# EAGLE schematic chok_boi (EAGLE 8.3.2)
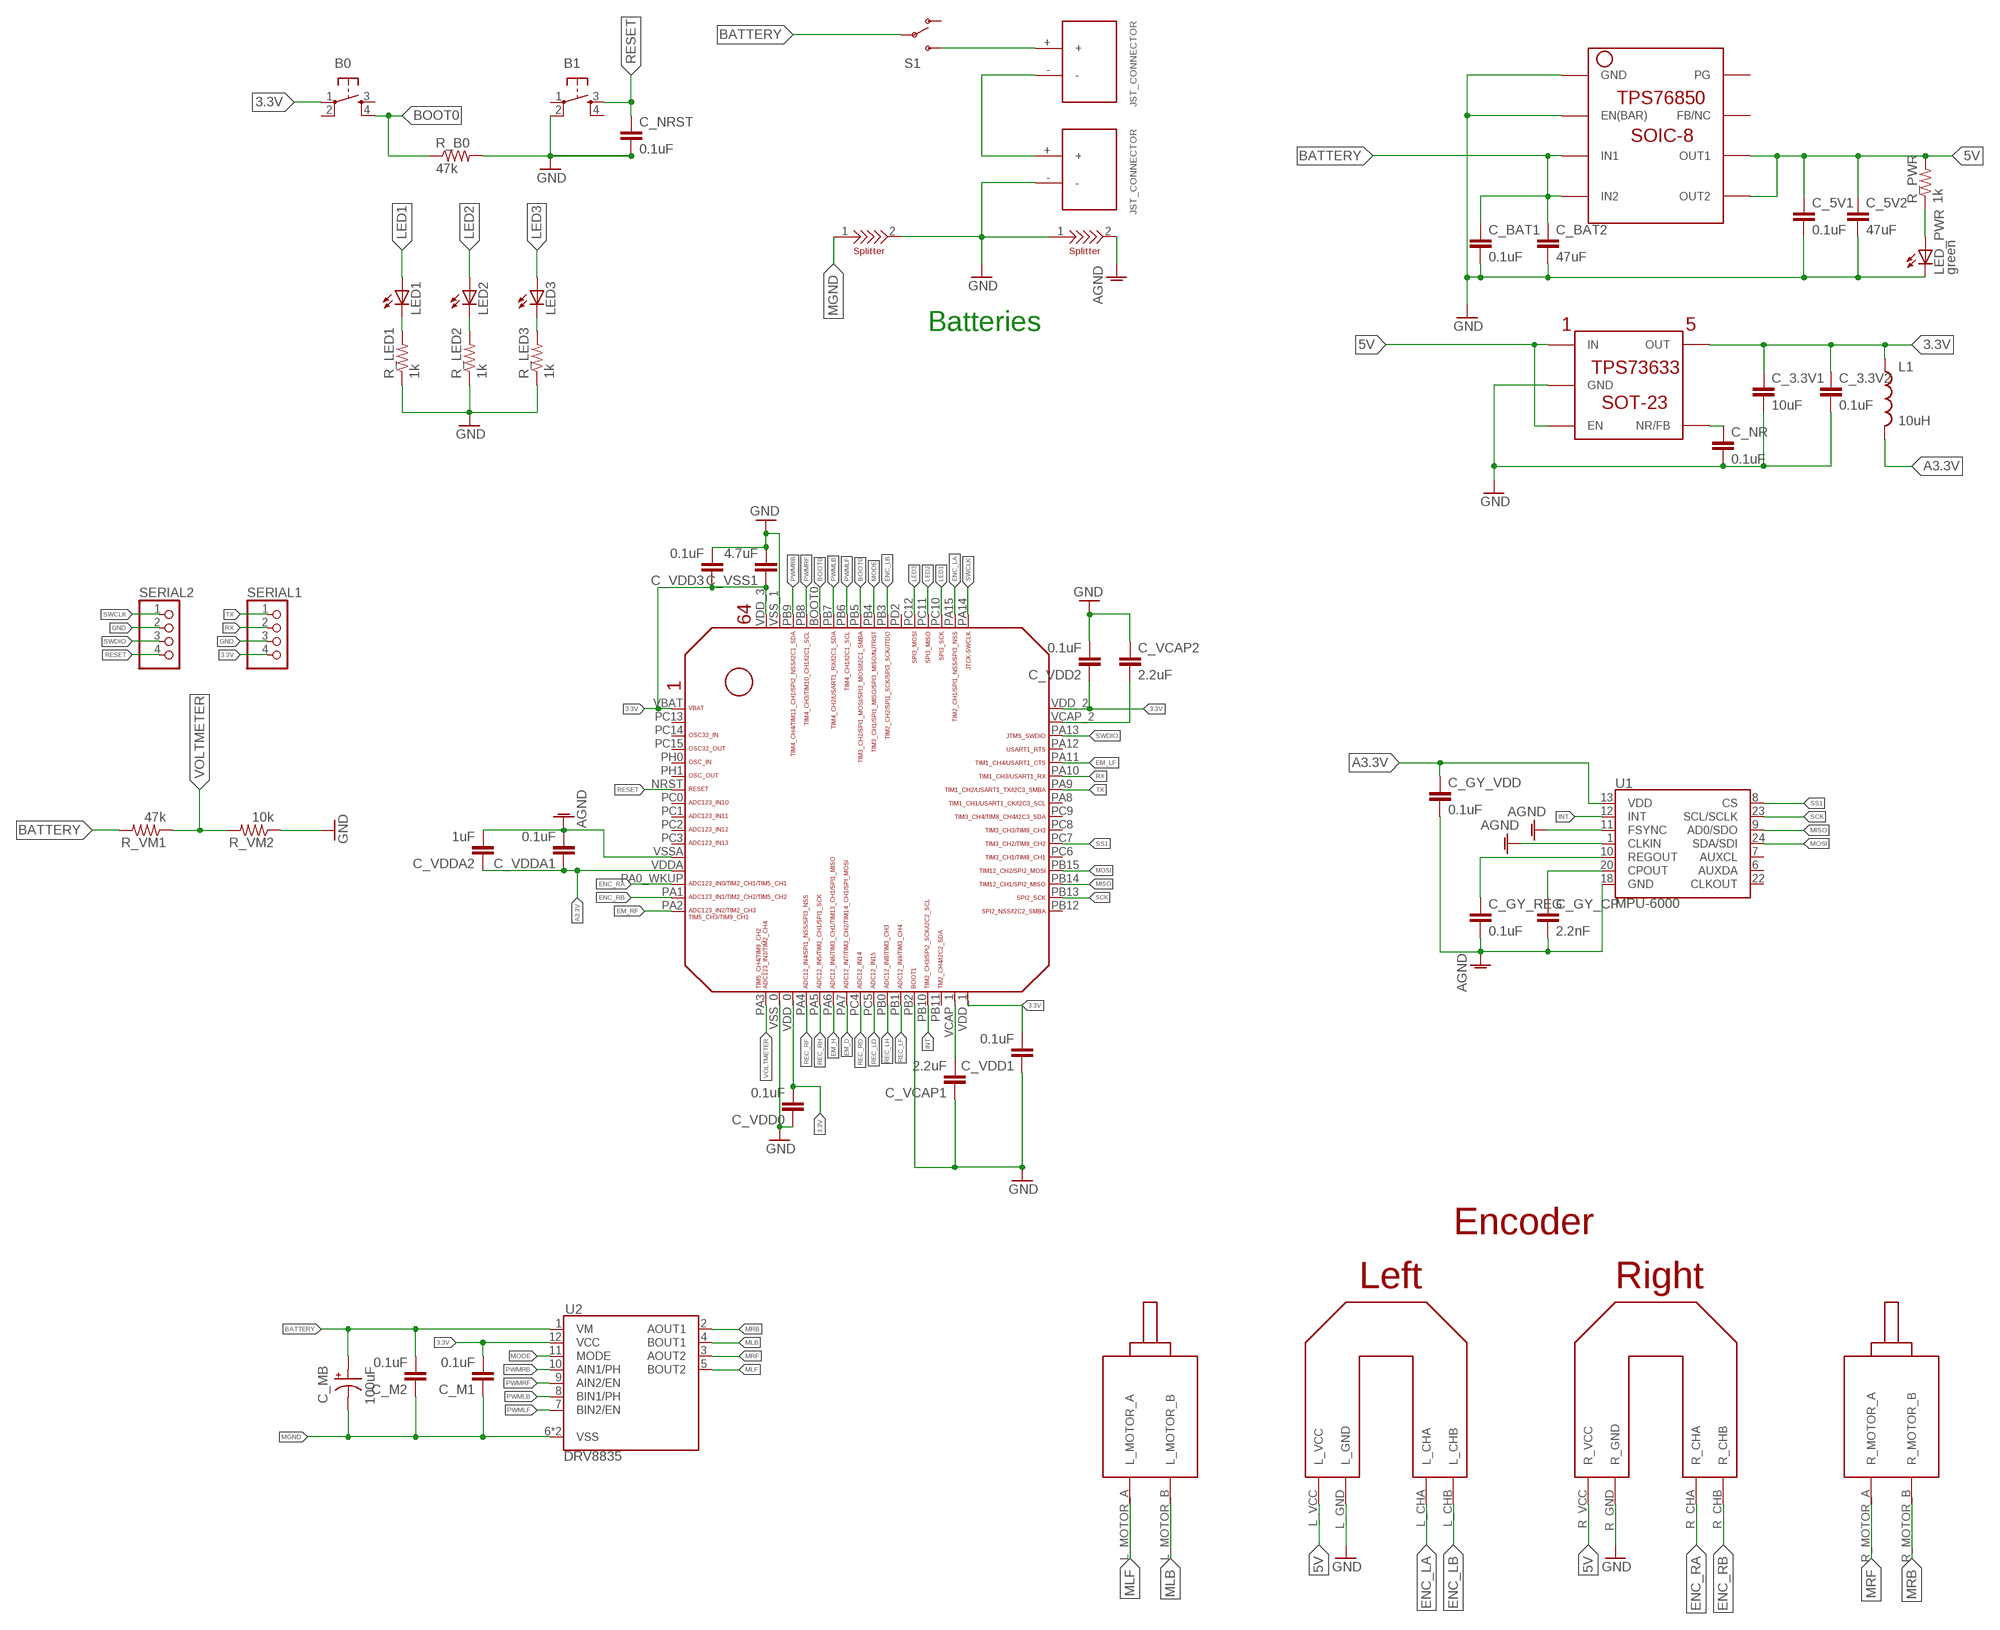
[diagram p0: schematic, sheet 1, part 1 of 2]
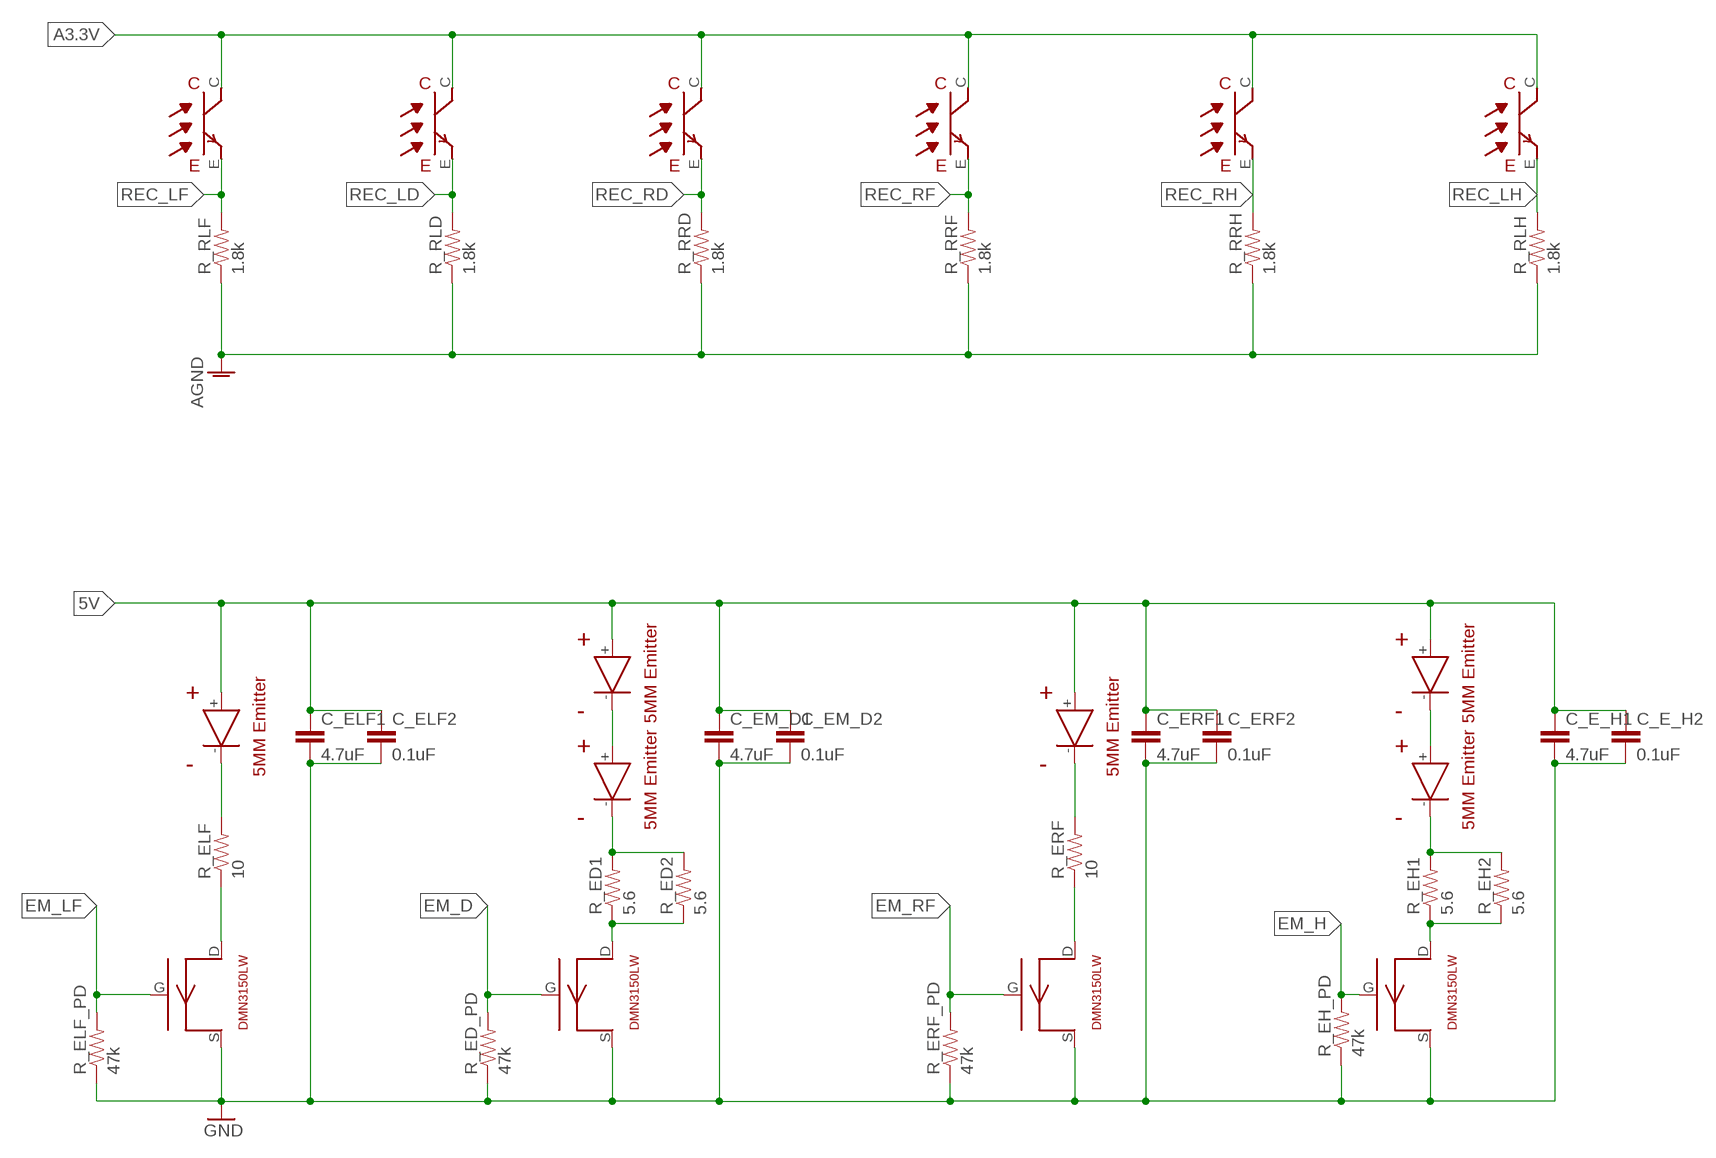
[diagram p1: schematic, sheet 1, part 2 of 2]

## Parts
B0  TAC_SWITCHSMD  [TACTILE-SWITCH-SMD]
B1  TAC_SWITCHSMD  [TACTILE-SWITCH-SMD]
C_3.3V1  10uF  CAP0603-CAP  [0603-CAP]
C_3.3V2  0.1uF  CAP0603-CAP  [0603-CAP]
C_5V1  0.1uF  CAP0603-CAP  [0603-CAP]
C_5V2  47uF  CAP1210  [1210]
C_BAT1  0.1uF  CAP0603-CAP  [0603-CAP]
C_BAT2  47uF  CAP1210  [1210]
C_E_H1  4.7uF  CAP0603-CAP  [0603-CAP]
C_E_H2  0.1uF  CAP0603-CAP  [0603-CAP]
C_ELF1  4.7uF  CAP0603-CAP  [0603-CAP]
C_ELF2  0.1uF  CAP0603-CAP  [0603-CAP]
C_EM_D1  4.7uF  CAP0603-CAP  [0603-CAP]
C_EM_D2  0.1uF  CAP0603-CAP  [0603-CAP]
C_ERF1  4.7uF  CAP0603-CAP  [0603-CAP]
C_ERF2  0.1uF  CAP0603-CAP  [0603-CAP]
C_GY_CP  2.2nF  CAP0603-CAP  [0603-CAP]
C_GY_REG  0.1uF  CAP0603-CAP  [0603-CAP]
C_GY_VDD  0.1uF  CAP0603-CAP  [0603-CAP]
C_M1  0.1uF  CAP0603-CAP  [0603-CAP]
C_M2  0.1uF  CAP0603-CAP  [0603-CAP]
C_MB  100uF  T491X107K025AT  [X]
C_NR  0.1uF  CAP0603-CAP  [0603-CAP]
C_NRST  0.1uF  CAP0603-CAP  [0603-CAP]
C_VCAP1  2.2uF  CAP0603-CAP  [0603-CAP]
C_VCAP2  2.2uF  CAP0603-CAP  [0603-CAP]
C_VDD0  0.1uF  CAP0603-CAP  [0603-CAP]
C_VDD1  0.1uF  CAP0603-CAP  [0603-CAP]
C_VDD2  0.1uF  CAP0603-CAP  [0603-CAP]
C_VDD3  0.1uF  CAP0603-CAP  [0603-CAP]
C_VDDA1  0.1uF  CAP0603-CAP  [0603-CAP]
C_VDDA2  1uF  CAP0603-CAP  [0603-CAP]
C_VSS1  4.7uF  CAP0603-CAP  [0603-CAP]
L1  10uH  INDUCTOR1007  [1007]
LED1  LED0603  [LED-0603]
LED2  LED0603  [LED-0603]
LED3  LED0603  [LED-0603]
LED_PWR  green  LED1206  [LED-1206]
LEFT_FRONT_EMITTER  EMITTER  [EMITTER]
NMOS1  DMN3150LW  [DMN3150LW]
NMOS2  DMN3150LW  [DMN3150LW]
NMOS3  DMN3150LW  [DMN3150LW]
NMOS4  DMN3150LW  [DMN3150LW]
R_B0  47k  RESISTOR0603-RES  [0603-RES]
R_ED1  5.6  RESISTOR0603-RES  [0603-RES]
R_ED2  5.6  RESISTOR0603-RES  [0603-RES]
R_ED_PD  47k  RESISTOR0603-RES  [0603-RES]
R_EH1  5.6  RESISTOR0603-RES  [0603-RES]
R_EH2  5.6  RESISTOR0603-RES  [0603-RES]
R_EH_PD  47k  RESISTOR0603-RES  [0603-RES]
R_ELF  10  RESISTOR0603-RES  [0603-RES]
R_ELF_PD  47k  RESISTOR0603-RES  [0603-RES]
R_ERF  10  RESISTOR0603-RES  [0603-RES]
R_ERF_PD  47k  RESISTOR0603-RES  [0603-RES]
R_LED1  1k  RESISTOR0603-RES  [0603-RES]
R_LED2  1k  RESISTOR0603-RES  [0603-RES]
R_LED3  1k  RESISTOR0603-RES  [0603-RES]
R_PWR  1k  RESISTOR0603-RES  [0603-RES]
R_RLD  1.8k  RESISTOR0603-RES  [0603-RES]
R_RLF  1.8k  RESISTOR0603-RES  [0603-RES]
R_RLH  1.8k  RESISTOR0603-RES  [0603-RES]
R_RRD  1.8k  RESISTOR0603-RES  [0603-RES]
R_RRF  1.8k  RESISTOR0603-RES  [0603-RES]
R_RRH  1.8k  RESISTOR0603-RES  [0603-RES]
R_VM1  47k  RESISTOR0603-RES  [0603-RES]
R_VM2  10k  RESISTOR0603-RES  [0603-RES]
REC_LF  RECEIVER  [RECEIVER]
S1  SWITCH-SPSTPTH  [SWITCH-SPDT]
SERIAL1  PINHD-1X4  [1X04]
SERIAL2  PINHD-1X4  [1X04]
U1  MPU-6000  [QFN-24-EP]
U2  DRV8835  DRV883X  [WSON-12]
U$1  JST_CONNECTOR_FEMALE  [JST_CONNECTOR_FEMALE]
U$2  JST_CONNECTOR_FEMALE  [JST_CONNECTOR_FEMALE]
U$3  TPS73633(SOT-23)  [TPS73633(SOT-23)]
U$4  TPS76850(SOIC-8)  [TPS76850(SOIC-8)]
U$5  STM32F405/415_LQFP64  [STM32F405/415_LQFP64]
U$7  RECEIVER  [RECEIVER]
U$8  RECEIVER  [RECEIVER]
U$9  RECEIVER  [RECEIVER]
U$11  EMITTER  [EMITTER]
U$12  FUTURA_V1.0_MOTOR_MOUNT  [FUTURA_V1.0_MOTOT_MOUNT]
U$13  EMITTER  [EMITTER]
U$15  SPLITTER  [SPLITTER]
U$16  SPLITTER  [SPLITTER]
U$17  EMITTER  [EMITTER]
U$18  EMITTER  [EMITTER]
U$19  EMITTER  [EMITTER]
U$20  RECEIVER  [RECEIVER]
U$21  RECEIVER  [RECEIVER]

## Nets
3.3V: B0.1 C_3.3V1.1 C_3.3V2.1 C_M1.2 C_VDD0.2 C_VDD1.2 C_VDD2.1 C_VDD3.1 C_VSS1.1 L1.1 SERIAL1.4 U2.12(VCC) U$3.OUT U$5.VBAT U$5.VDD_0 U$5.VDD_1 U$5.VDD_2 U$5.VDD_3
5V: C_5V1.1 C_5V2.1 C_E_H1.1 C_E_H2.1 C_ELF1.1 C_ELF2.1 C_EM_D1.1 C_EM_D2.1 C_ERF1.1 C_ERF2.1 LEFT_FRONT_EMITTER.+ R_PWR.2 U$3.EN U$3.IN U$4.OUT1 U$4.OUT2 U$11.+ U$12.L_VCC U$12.R_VCC U$13.+ U$18.+
A3.3V: C_GY_VDD.1 C_VDDA1.1 C_VDDA2.1 L1.2 REC_LF.C U1.13(VDD) U$5.VDDA U$7.C U$8.C U$9.C U$20.C U$21.C
AGND: C_GY_CP.2 C_GY_REG.2 C_GY_VDD.2 C_VDDA1.2 C_VDDA2.2 R_RLD.1 R_RLF.1 R_RLH.1 R_RRD.1 R_RRF.1 R_RRH.1 U1.1(CLKIN) U1.11(FSYNC) U1.18(GND) U$5.VSSA U$15.2
BATTERY: C_BAT1.1 C_BAT2.1 C_M2.2 C_MB.A R_VM1.2 S1.2(P) U2.1(VM) U$4.IN1 U$4.IN2
BOOT0: B0.4 R_B0.1 U$5.BOOT0 U$5.PB5
D2_EM: R_ED1.2 R_ED2.2 U$17.-
D_EM: U$11.- U$17.+
EM_D: NMOS2.G R_ED_PD.2 U$5.PA7
EM_H: NMOS4.G R_EH_PD.2 U$5.PA6
EM_LF: NMOS1.G R_ELF_PD.2 U$5.PA11
EM_RF: NMOS3.G R_ERF_PD.2 U$5.PA2
ENC_LA: U$5.PA15 U$12.L_CHA
ENC_LB: U$5.PB3 U$12.L_CHB
ENC_RA: U$5.PA0_WKUP(PA0_AKUP) U$12.R_CHA
ENC_RB: U$5.PA1 U$12.R_CHB
GND: B1.2 C_3.3V1.2 C_3.3V2.2 C_5V1.2 C_5V2.2 C_BAT1.2 C_BAT2.2 C_E_H1.2 C_E_H2.2 C_ELF1.2 C_ELF2.2 C_EM_D1.2 C_EM_D2.2 C_ERF1.2 C_ERF2.2 C_NR.2 C_NRST.2 C_VCAP1.1 C_VCAP2.1 C_VDD0.1 C_VDD1.1 C_VDD2.2 C_VDD3.2 C_VSS1.2 LED_PWR.C NMOS1.S NMOS2.S NMOS3.S NMOS4.S R_B0.2 R_ED_PD.1 R_EH_PD.1 R_ELF_PD.1 R_ERF_PD.1 R_LED1.1 R_LED2.1 R_LED3.1 R_VM2.1 SERIAL1.3 SERIAL2.2 U$1.- U$3.GND U$4.EN(BAR) U$4.GND U$5.PB2 U$5.VSS_0 U$5.VSS_1 U$12.L_GND U$12.R_GND U$15.1 U$16.2
H2_EM: R_EH1.2 R_EH2.2 U$19.-
H_EM: U$18.- U$19.+
INT: U1.12(INT) U$5.PB10
LED1: LED1.A U$5.PC10
LED2: LED2.A U$5.PC11
LED3: LED3.A U$5.PC12
LF_EM: LEFT_FRONT_EMITTER.- R_ELF.2
MGND: C_M1.1 C_M2.1 C_MB.C U2.6(VSS) U2.PAD(VSS) U$16.1
MISO: U1.9(AD0/SDO) U$5.PB14
MLB: U2.4(BOUT1) U$12.L_MOTOR_B
MLF: U2.5(BOUT2) U$12.L_MOTOR_A
MODE: U2.11(MODE) U$5.PB4
MOSI: U1.24(SDA/SDI) U$5.PB15
MRB: U2.2(AOUT1) U$12.R_MOTOR_B
MRF: U2.3(AOUT2) U$12.R_MOTOR_A
N$1: U$1.+ U$2.-
N$2: S1.3(S) U$2.+
N$3: C_NR.1 U$3.NR/FB
N$4: C_VCAP1.2 U$5.VCAP_1
N$5: NMOS3.D R_ERF.1
N$6: C_VCAP2.2 U$5.VCAP_2
N$7: NMOS1.D R_ELF.1
N$8: LED_PWR.A R_PWR.1
N$12: LED1.C R_LED1.2
N$16: LED2.C R_LED2.2
N$18: NMOS2.D R_ED1.1 R_ED2.1
N$19: NMOS4.D R_EH1.1 R_EH2.1
N$20: C_GY_REG.1 U1.10(REGOUT)
N$21: LED3.C R_LED3.2
N$22: C_GY_CP.1 U1.20(CPOUT)
PWMLB: U2.8(BIN1/PH) U$5.PB7
PWMLF: U2.7(BIN2/EN) U$5.PB6
PWMRB: U2.10(AIN1/PH) U$5.PB9
PWMRF: U2.9(AIN2/EN) U$5.PB8
REC_LD: R_RLD.2 U$5.PC5 U$7.E
REC_LF: R_RLF.2 REC_LF.E U$5.PB1
REC_LH: R_RLH.2 U$5.PB0 U$21.E
REC_RD: R_RRD.2 U$5.PC4 U$8.E
REC_RF: R_RRF.2 U$5.PA4 U$9.E
REC_RH: R_RRH.2 U$5.PA5 U$20.E
RESET: B1.3 C_NRST.1 SERIAL2.4 U$5.NRST
RF_EM: R_ERF.2 U$13.-
RX: SERIAL1.2 U$5.PA10
SCK: U1.23(SCL/SCLK) U$5.PB13
SS1: U1.8(CS) U$5.PC7
SWCLK: SERIAL2.1 U$5.PA14
SWDIO: SERIAL2.3 U$5.PA13
TX: SERIAL1.1 U$5.PA9
VOLTMETER: R_VM1.1 R_VM2.2 U$5.PA3
Unconnected: B0.2 B0.3 B1.1 B1.4 S1.1(O) U1.6(AUXDA) U1.7(AUXCL) U1.22(CLKOUT) U$4.FB/NC U$4.PG U$5.PA8 U$5.PA12 U$5.PB11 U$5.PB12 U$5.PC0 U$5.PC1 U$5.PC2 U$5.PC3 U$5.PC6 U$5.PC8 U$5.PC9 U$5.PC13 U$5.PC14 U$5.PC15 U$5.PD2 U$5.PH0 U$5.PH1

## Notes on the sheet
- Batteries

## Library data of the parts
B0 B1 = SparkFun-Retired:TAC_SWITCH: Momentary Switch Button commonly used for reset or general input. Spark Fun Electronics SKU : COM-00097 SMT- SWCH-08247; PROD_ID: SWCH-08247; VALUE: TAC_SWITCHSMD
C_3.3V1 C_3.3V2 C_5V1 C_5V2 C_BAT2 C_GY_CP C_GY_REG C_GY_VDD C_M1 C_M2 C_NR C_NRST C_VCAP1 C_VCAP2 C_VDD1 C_VDD3 C_VDDA1 C_VDDA2 C_VSS1 = SparkFun:CAP: Capacitor Standard 0603 ceramic capacitor, and 0.1" leaded capacitor.
C_BAT1 C_E_H1 C_E_H2 C_ELF1 C_ELF2 C_EM_D1 C_EM_D2 C_ERF1 C_ERF2 C_VDD0 C_VDD2 = SparkFun-Capacitors:CAP: Capacitor Standard 0603 ceramic capacitor, and 0.1" leaded capacitor.
C_MB = Volks73-Kemet:T491?*: Tantalum Surface Mount Capacitor - Standard Tantalum T491 Series Industrial Grade MnO2 Documentation Datasheet <http://www.kemet.com/Lists/ProductCatalog/Attachments/254/KEM_T2005_T491.pdf> Overview The KEMET T491 Series, designed specifially for today’s highly automated surface mount processes and equipment, is the leading choice for surface mount designs. The T491 combines KEMET’s proven solid tantalum technology, acclaimed and respected throughout the world, with the latest in materials, processes and automation, resulting in unsurpassed total performance and value. This product meets or exceeds the requirements of EIA standard 535BAAC. This series is classifid as MSL (Moisture Sensitivity Level) 1 under J STD 020: unlimited flor life time at ≤30°C / 85% RH. The T491 standard terminations are available in 100% matte tin and provide excellent wetting characteristics and compatibility with today's surface mount solder systems. Tin/lead (Sn/Pb) terminations are available upon request for any part number. Gold-plated terminations are also available for use with conductive epoxy attachment processes. Standard packaging of these devices is tape and reel in accordance with EIA 481. This system provides perfect compatibility with all tape-fed placement units. Benefits Meets or exceeds EIA Standard 535BAAC Taped and reeled per EIA 481 Symmetrical, compliant terminations Optional gold-plated terminations Laser-marked case 100% surge current test on C, D, E, U, V, X sizes Halogen free epoxy Capacitance 0.1 µF to 1,000 µF Tolerance ±10%, ±20% Voltage 2.5 – 50 VDC Extended range values Low profie case sizes RoHS Compliant and lead-free terminations (See www.kemet.com for transition information) Operating temperature: -55ºC to +125ºC; CAPACITANCE: 100uF; CATEGORY: Capacitors; DESCRIPTION: CAP TANT 100UF 25V 10% 2917; DOCUMENTATION_LINK: <a href="http://www.kemet.com/Lists/ProductCatalog/Attachments/254/KEM_T2005_T491.pdf">Datasheet</a>; DOCUMENTATION_URL: http://www.kemet.com/Lists/ProductCatalog/Attachments/254/KEM_T2005_T491.pdf; ESR: 300 mOhm; FAMILY: Tantalum Capacitors; FEATURES: General Purpose; HEIGHT-SEATED: 0.169" (4.30mm); LEAD_SPACING: -; MANUFACTURER: Kemet; MANUFACTURER_SIZE_CODE: X; MOUNTING_TYPE: Surface Mount; OPERATING_TEMPERATURE: -55C ~ 125C; PACKAGE: 2917 (7343 Metric); PART_NUMBER: T491X107K025AT; SERIES: T491; SIZE: 0.287" L x 0.169" W (7.30mm x 4.30mm); SUPPLIER_ITEM_INFO: http://www.digikey.com/product-detail/en/T491X107K025AT/399-8410-1-ND/3472133; SUPPLIER_ITEM_LINK: <a href="">Details</a>; SUPPLIER_ITEM_NUMBER: 399-8410-1-ND; SUPPLIER_LINK: <a href="http://www.digikey.com">Home Page</a>; SUPPLIER_NAME: Digi-Key; SUPPLIER_URL: http://www.digikey.com; TOLERANCE: 10%; TYPE: Molded; VOLTAGE-RATED: 25V
L1 = SparkFun-Passives:INDUCTOR: Inductors Basic Inductor/Choke - 0603 and 1206. Footprints are not proven and vary greatly between part numbers. INDUCTOR POWER 3.3UH 4.0A SMD 0.197" L x 0.197" W x 0.177" H (5.00mm x 5.00mm x 4.50mm)
LED1-LED3 LED_PWR = SparkFun:LED: LEDs Standard schematic elements and footprints for 5mm, 3mm, 1206, and 0603 sized LEDs. 5mm - Spark Fun Electronics SKU : COM-00529 (and others)
LEFT_FRONT_EMITTER U$11 U$13 U$17-U$19 = sfh4550 _ teft4300:EMITTER
NMOS1-NMOS4 = DMN3150LW:DMN3150LW
R_B0 R_ED1 R_ED2 R_ED_PD R_EH1 R_EH2 R_EH_PD R_ELF R_ELF_PD R_ERF R_ERF_PD R_LED1-R_LED3 R_PWR R_RLD R_RLF R_RLH R_RRD R_RRF R_RRH R_VM1 R_VM2 = SparkFun-Passives:RESISTOR: Resistor Basic schematic elements and footprints for 0603, 1206, and PTH resistors.
REC_LF U$7-U$9 U$20 U$21 = sfh4550 _ teft4300:RECEIVER
S1 = SparkFun:SWITCH-SPST: SPST Switch Simple slide switch. Spark Fun Electronics SKU : COM-00102
SERIAL1 SERIAL2 = pinhead:PINHD-1X4: PIN HEADER
U1 = SparkFun-Sensors:MPU-6000: Invensense MPU-6000 6-Axis Gryoscope/Accelerometer 3-axis gyroscope, 3-axis accelerometer in a 4x4 package. The MPU-6000 is the world’s first 6-axis I²C MotionTracking device designed for the low power, low cost, and high performance requirements of smartphones, tablets and wearable sensors. Datasheet <http://cdn.sparkfun.com/datasheets/Components/General%20IC/PS-MPU-6000A.pdf> SparkFun Products MPU-6000 - Motion Processing Unit <https://www.sparkfun.com/products/11234> (SEN-11234) SparkFun UDB5 - PIC UAV Development Board <https://www.sparkfun.com/products/11703> (GPS-11703); PROD_ID: IC-11089; SF_ID: SEN-11234
U2 = SparkFun-IC-Special-Function:DRV883X: DRV8835 2 Channel Motor Driver Dual 1.5A H-bridge, 2-11V Datasheet <http://www.ti.com/lit/ds/symlink/drv8835.pdf> SparkFun Products: SparkFun Serial Controlled Motor Driver <https://www.sparkfun.com/products/13911>; PROD_ID: IC-13342
U$1 U$2 = JST_CONNECTOR_FEMALE. through hole:JST_CONNECTOR_FEMALE
U$3 = TPS73633(SOT-23):TPS73633(SOT-23)
U$4 = TPS76850(SOIC-8):TPS76850(SOIC-8)
U$5 = STM32F10x F4xx:STM32F405/415_LQFP64
U$12 = Futura 1.0 motor mount template:FUTURA_V1.0_MOTOR_MOUNT
U$15 U$16 = splitter:SPLITTER